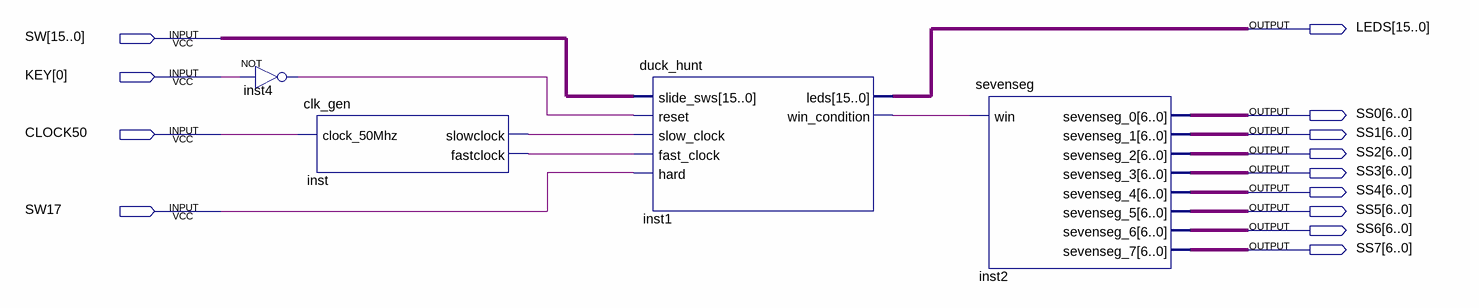
[diagram p0: schematic sheet]
// Quartus schematic DuckHuntTop.bdf as structural Verilog: 4 symbols, 13 pins
module DuckHuntTop (
  input  [15:0] SW,
  input  [0:0] KEY,
  input  CLOCK50,
  input  SW17,
  output [15:0] LEDS,
  output [6:0] SS0,
  output [6:0] SS1,
  output [6:0] SS2,
  output [6:0] SS3,
  output [6:0] SS4,
  output [6:0] SS5,
  output [6:0] SS6,
  output [6:0] SS7
);

  wire inst1_win_condition, inst4_out, inst_fastclock, inst_slowclock;

  not inst4 (inst4_out, KEY[0]);
  clk_gen inst (.clock_50Mhz(CLOCK50), .slowclock(inst_slowclock), .fastclock(inst_fastclock));
  duck_hunt inst1 (
    .slide_sws(SW), .reset(inst4_out), .slow_clock(inst_slowclock), .fast_clock(inst_fastclock), .hard(SW17),
    .leds(LEDS), .win_condition(inst1_win_condition));
  sevenseg inst2 (
    .win(inst1_win_condition), .sevenseg_0(SS0), .sevenseg_1(SS1), .sevenseg_2(SS2), .sevenseg_3(SS3),
    .sevenseg_4(SS4), .sevenseg_5(SS5), .sevenseg_6(SS6), .sevenseg_7(SS7));
endmodule
